# Altium project SnippetsInterfaces.PrjPCB
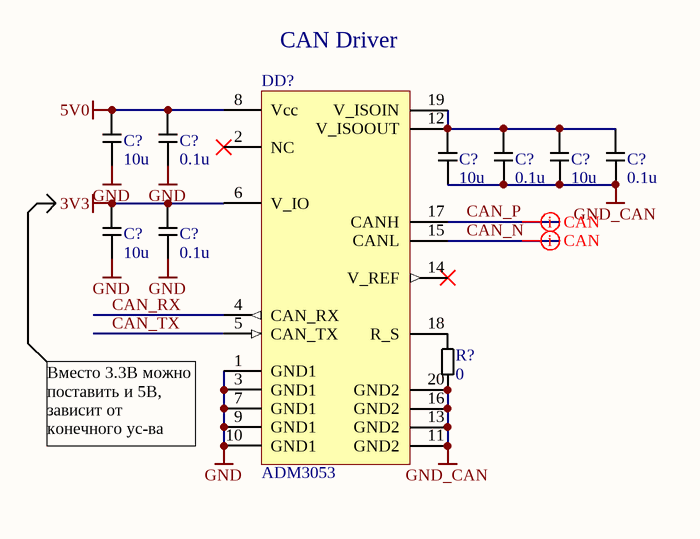
[diagram p0: CAN_ADM3053_Isolated_internal_DCDC.SchDoc]
5 sheets, 70 parts. Net scope: global (net labels, ports and power ports of the same name join across sheets).
Sheets:
  CAN_ADM3053_Isolated_internal_DCDC.SchDoc
  Ethernet_LAN8720_simple.SchDoc
  Ethernet_LAN8742A_simple.SchDoc
  RS232_MAX3232_simple.SchDoc
  RS232_MAX3232_with_rts_cts.SchDoc

## Sheet CAN_ADM3053_Isolated_internal_DCDC.SchDoc
size 420 x 297 mm

### Parts
(Parts that share a designator on the sheet are numbered #1, #2 ... from top to bottom, then left to right.)
C?#1  10u  [C0603]
C?#2  0.1u  [C0603]
C?#3  10u  [C0603]
C?#4  0.1u  [C0603]
C?#5  10u  [C0603]
C?#6  0.1u  [C0603]
C?#7  10u  [C0603]
C?#8  0.1u  [C0603]
DD?#1  ADM3053  [SO-20W]
R?#1  0  [R0603]

### Nets
3V3: C?#7.1 C?#8.1 DD?#1.6(V_IO)
5V0: C?#1.1 C?#2.1 DD?#1.8(Vcc)
GND: C?#1.2 C?#2.2 C?#7.2 C?#8.2 DD?#1.1(GND1) DD?#1.3(GND1) DD?#1.7(GND1) DD?#1.9(GND1) DD?#1.10(GND1)
GND_CAN: C?#3.2 C?#4.2 C?#5.2 C?#6.2 DD?#1.11(GND2) DD?#1.13(GND2) DD?#1.16(GND2) DD?#1.20(GND2) R?#1.2
CAN_N: DD?#1.15(CANL)
CAN_P: DD?#1.17(CANH)
CAN_RX: DD?#1.4(CAN_RX)
CAN_TX: DD?#1.5(CAN_TX)
NetC?#3_1: C?#3.1 C?#4.1 C?#5.1 C?#6.1 DD?#1.12(V_ISOOUT) DD?#1.19(V_ISOIN)
NetDD?#1_18: DD?#1.18(R_S) R?#1.1

Not connected (* = marked no-connect by the designer): DD?#1 2(NC)* 14(V_REF)*

### Layout directives
differential pair: CAN_N, CAN_P

### Notes on the sheet
- (near DD?#1) CAN Driver
- (near DD?#1) Вместо 3.3В можно поставить и 5В, зависит от конечного ус-ва

### Library data of the parts
C?#1-C?#8 = C: Capacitor
DD?#1 = ADM3053: Isolated CAN transceiver with isolated DC-DC
R?#1 = R: Resistor

## Sheet Ethernet_LAN8720_simple.SchDoc
size A4
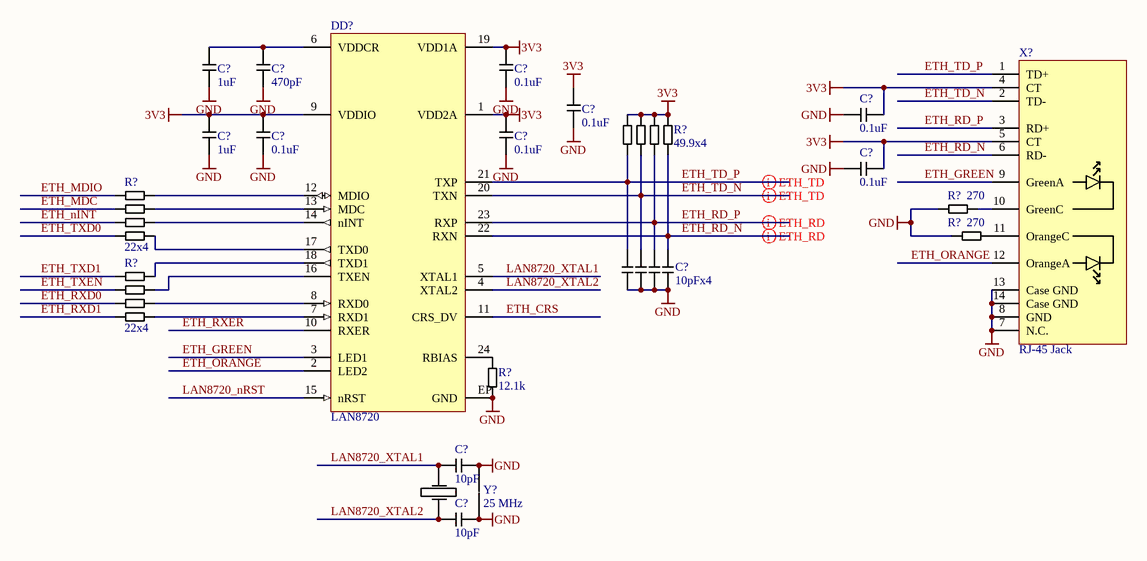
[diagram p1: Ethernet_LAN8720_simple.SchDoc]

### Parts
(Parts that share a designator on the sheet are numbered #1, #2 ... from top to bottom, then left to right.)
C?#9  1uF  [C0603]
C?#10  470pF  [C0603]
C?#11  0.1uF  [C0603]
C?#12  0.1uF  [C0603]
C?#13  0.1uF  [C0603]
C?#14  1uF  [C0603]
C?#15  0.1uF  [C0603]
C?#16  0.1uF  [C0603]
C?#17  0.1uF  [C0603]
C?#18  10pFx4  [C0612-4]
C?#19  10pF  [C0603]
C?#20  10pF  [C0603]
DD?#2  LAN8720  [QFN-24]
R?#2  49.9x4  [R0612-4]
R?#3  22x4  [R0612-4]
R?#4  270  [R0603]
R?#5  270  [R0603]
R?#6  22x4  [R0612-4]
R?#7  12.1k  [R0603]
X?#1  RJ-45 Jack  [J011D21BNL]
Y?#1  25 MHz  [Xtal 0532]

### Nets
3V3: C?#11.1 C?#12.2 C?#13.2 C?#14.1 C?#15.1 C?#16.1 C?#17.2 DD?#2.1(VDD2A) DD?#2.9(VDDIO) DD?#2.19(VDD1A) R?#2.1 R?#2.2 R?#2.3 R?#2.4 X?#1.4(CT) X?#1.5(CT)
GND: C?#9.2 C?#10.2 C?#11.2 C?#12.1 C?#13.1 C?#14.2 C?#15.2 C?#16.2 C?#17.1 C?#18.5 C?#18.6 C?#18.7 C?#18.8 C?#19.2 C?#20.2 DD?#2.EP(GND) R?#4.1 R?#5.1 R?#7.1 X?#1.7(N.C.) X?#1.8(GND) X?#1.13(Case_GND) X?#1.14(Case_GND) Y?#1.1(X1) Y?#1.3(X2)
ETH_CRS: DD?#2.11(CRS_DV)
ETH_GREEN: DD?#2.3(LED1) X?#1.9(GreenA)
ETH_MDC: R?#3.3
ETH_MDIO: R?#3.4
ETH_nINT: R?#3.2
ETH_ORANGE: DD?#2.2(LED2) X?#1.12(OrangeA)
ETH_RD_N: C?#18.4 DD?#2.22(RXN) R?#2.5 X?#1.6(RD-)
ETH_RD_P: C?#18.3 DD?#2.23(RXP) R?#2.6 X?#1.3(RD+)
ETH_RXD0: R?#6.2
ETH_RXD1: R?#6.1
ETH_RXER: DD?#2.10(RXER)
ETH_TD_N: C?#18.2 DD?#2.20(TXN) R?#2.7 X?#1.2(TD-)
ETH_TD_P: C?#18.1 DD?#2.21(TXP) R?#2.8 X?#1.1(TD+)
ETH_TXD0: R?#3.1
ETH_TXD1: R?#6.4
ETH_TXEN: R?#6.3
LAN8720_nRST: DD?#2.15(nRST)
LAN8720_XTAL1: C?#19.1 DD?#2.5(XTAL1) Y?#1.4(GND)
LAN8720_XTAL2: C?#20.1 DD?#2.4(XTAL2) Y?#1.2(GND)
NetC?#9_1: C?#9.1 C?#10.1 DD?#2.6(VDDCR)
NetDD?#2_7: DD?#2.7(RXD1) R?#6.8
NetDD?#2_8: DD?#2.8(RXD0) R?#6.7
NetDD?#2_12: DD?#2.12(MDIO) R?#3.5
NetDD?#2_13: DD?#2.13(MDC) R?#3.6
NetDD?#2_14: DD?#2.14(nINT) R?#3.7
NetDD?#2_16: DD?#2.16(TXEN) R?#6.6
NetDD?#2_17: DD?#2.17(TXD0) R?#3.8
NetDD?#2_18: DD?#2.18(TXD1) R?#6.5
NetDD?#2_24: DD?#2.24(RBIAS) R?#7.2
NetR?#4_2: R?#4.2 X?#1.10(GreenC)
NetR?#5_2: R?#5.2 X?#1.11(OrangeC)

### Layout directives
differential pair: ETH_RD_N, ETH_RD_P, ETH_TD_N, ETH_TD_P

### Library data of the parts
C?#9-C?#17 C?#19 C?#20 = C: Capacitor
C?#18 = Cx4: Capacitors array
DD?#2 = LAN8720: Ethernet PHY
R?#2 R?#3 R?#6 = Rx4: Resistors array
R?#4 R?#5 R?#7 = R: Resistor
X?#1 = RJ-45 Jack: Ethernet jack
Y?#1 = Xtal: Quartz crystal

## Sheet Ethernet_LAN8742A_simple.SchDoc
size A4
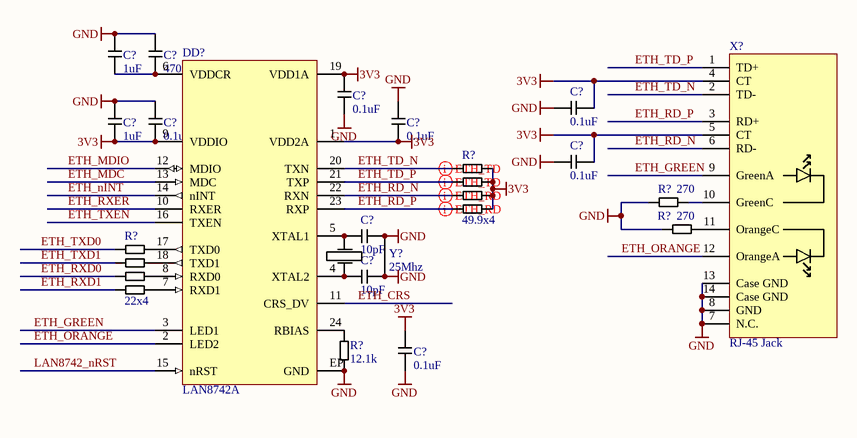
[diagram p2: Ethernet_LAN8742A_simple.SchDoc]

### Parts
(Parts that share a designator on the sheet are numbered #1, #2 ... from top to bottom, then left to right.)
C?#21  1uF  [C0603]
C?#22  470pF  [C0603]
C?#23  0.1uF  [C0603]
C?#24  0.1uF  [C0603]
C?#25  1uF  [C0603]
C?#26  0.1uF  [C0603]
C?#27  0.1uF  [C0603]
C?#28  0.1uF  [C0603]
C?#29  10pF  [C0603]
C?#30  10pF  [C0603]
C?#31  0.1uF  [C0603]
DD?#3  LAN8742A  [QFN-24]
R?#8  49.9x4  [R0508-4]
R?#9  270  [R0603]
R?#10  270  [R0603]
R?#11  22x4  [R0508-4]
R?#12  12.1k  [R0603]
X?#2  RJ-45 Jack  [J011D21BNL]
Y?#2  25Mhz  [XTAL 2532]

### Nets
3V3: C?#23.1 C?#24.2 C?#25.2 C?#26.2 C?#27.2 C?#28.2 C?#31.2 DD?#3.1(VDD2A) DD?#3.9(VDDIO) DD?#3.19(VDD1A) R?#8.5 R?#8.6 R?#8.7 R?#8.8 X?#2.4(CT) X?#2.5(CT)
GND: C?#21.1 C?#22.1 C?#23.2 C?#24.1 C?#25.1 C?#26.1 C?#27.1 C?#28.1 C?#29.2 C?#30.2 C?#31.1 DD?#3.EP(GND) R?#9.1 R?#10.1 R?#12.1 X?#2.7(N.C.) X?#2.8(GND) X?#2.13(Case_GND) X?#2.14(Case_GND) Y?#2.1(GND) Y?#2.3(GND)
ETH_CRS: DD?#3.11(CRS_DV)
ETH_GREEN: DD?#3.3(LED1) X?#2.9(GreenA)
ETH_MDC: DD?#3.13(MDC)
ETH_MDIO: DD?#3.12(MDIO)
ETH_nINT: DD?#3.14(nINT)
ETH_ORANGE: DD?#3.2(LED2) X?#2.12(OrangeA)
ETH_RD_N: DD?#3.22(RXN) R?#8.2 X?#2.6(RD-)
ETH_RD_P: DD?#3.23(RXP) R?#8.1 X?#2.3(RD+)
ETH_RXD0: R?#11.2
ETH_RXD1: R?#11.1
ETH_RXER: DD?#3.10(RXER)
ETH_TD_N: DD?#3.20(TXN) R?#8.4 X?#2.2(TD-)
ETH_TD_P: DD?#3.21(TXP) R?#8.3 X?#2.1(TD+)
ETH_TXD0: R?#11.4
ETH_TXD1: R?#11.3
ETH_TXEN: DD?#3.16(TXEN)
LAN8742_nRST: DD?#3.15(nRST)
NetC?#21_2: C?#21.2 C?#22.2 DD?#3.6(VDDCR)
NetC?#29_1: C?#29.1 DD?#3.5(XTAL1) Y?#2.4(X2)
NetC?#30_1: C?#30.1 DD?#3.4(XTAL2) Y?#2.2(X1)
NetDD?#3_7: DD?#3.7(RXD1) R?#11.8
NetDD?#3_8: DD?#3.8(RXD0) R?#11.7
NetDD?#3_17: DD?#3.17(TXD0) R?#11.5
NetDD?#3_18: DD?#3.18(TXD1) R?#11.6
NetDD?#3_24: DD?#3.24(RBIAS) R?#12.2
NetR?#9_2: R?#9.2 X?#2.10(GreenC)
NetR?#10_2: R?#10.2 X?#2.11(OrangeC)

### Layout directives
differential pair: ETH_RD_N, ETH_RD_P, ETH_TD_N, ETH_TD_P

### Library data of the parts
C?#21-C?#31 = C: Capacitor
DD?#3 = LAN8742A: Ethernet PHY
R?#8 R?#11 = Rx4: Resistors array
R?#9 R?#10 R?#12 = R: Resistor
X?#2 = RJ-45 Jack: Ethernet jack
Y?#2 = Xtal: Quartz crystal

## Sheet RS232_MAX3232_simple.SchDoc
size A4
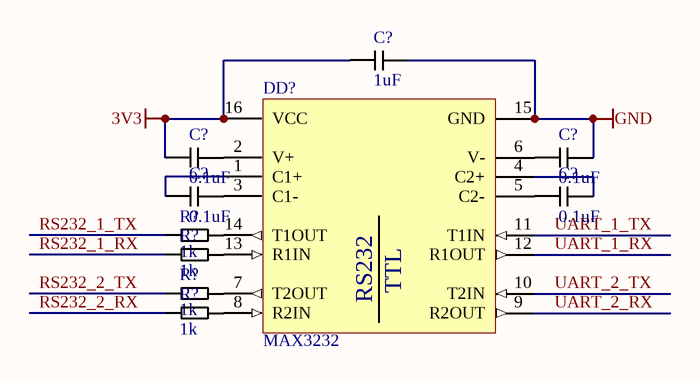
[diagram p3: RS232_MAX3232_simple.SchDoc]

### Parts
(Parts that share a designator on the sheet are numbered #1, #2 ... from top to bottom, then left to right.)
C?#32  1uF  [C0603]
C?#33  0.1uF  [C0603]
C?#34  0.1uF  [C0603]
C?#35  0.1uF  [C0603]
C?#36  0.1uF  [C0603]
DD?#4  MAX3232  [TSSOP-16]
R?#13  1k  [R0603]
R?#14  1k  [R0603]
R?#15  1k  [R0603]
R?#16  1k  [R0603]

### Nets
3V3: C?#32.1 C?#33.1 DD?#4.16(VCC)
GND: C?#32.2 C?#34.2 DD?#4.15(GND)
RS232_1_RX: R?#14.1
RS232_1_TX: R?#13.1
RS232_2_RX: R?#16.1
RS232_2_TX: R?#15.1
UART_1_RX: DD?#4.12(R1OUT)
UART_1_TX: DD?#4.11(T1IN)
UART_2_RX: DD?#4.9(R2OUT)
UART_2_TX: DD?#4.10(T2IN)
NetC?#33_2: C?#33.2 DD?#4.2(V+)
NetC?#34_1: C?#34.1 DD?#4.6(V-)
NetC?#35_1: C?#35.1 DD?#4.1(C1+)
NetC?#35_2: C?#35.2 DD?#4.3(C1-)
NetC?#36_1: C?#36.1 DD?#4.5(C2-)
NetC?#36_2: C?#36.2 DD?#4.4(C2+)
NetDD?#4_7: DD?#4.7(T2OUT) R?#15.2
NetDD?#4_8: DD?#4.8(R2IN) R?#16.2
NetDD?#4_13: DD?#4.13(R1IN) R?#14.2
NetDD?#4_14: DD?#4.14(T1OUT) R?#13.2

### Notes on the sheet
- (in symbol MAX3232) TTL; RS232

### Library data of the parts
C?#32-C?#36 = C: Capacitor
DD?#4 = MAX3232: MAX3232 TTL/CMOS<-->RS-232
R?#13-R?#16 = R: Resistor

## Sheet RS232_MAX3232_with_rts_cts.SchDoc
size A4
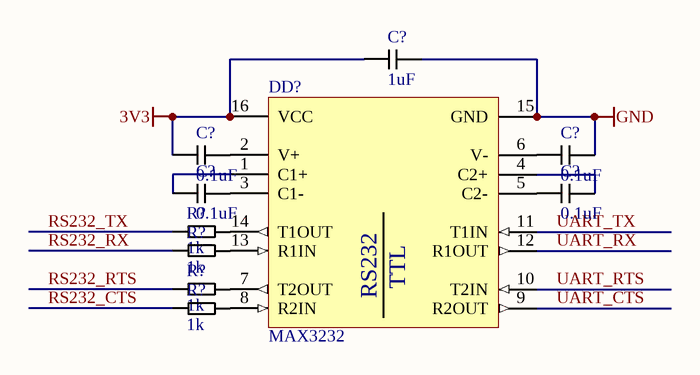
[diagram p4: RS232_MAX3232_with_rts_cts.SchDoc]

### Parts
(Parts that share a designator on the sheet are numbered #1, #2 ... from top to bottom, then left to right.)
C?#37  1uF  [C0603]
C?#38  0.1uF  [C0603]
C?#39  0.1uF  [C0603]
C?#40  0.1uF  [C0603]
C?#41  0.1uF  [C0603]
DD?#5  MAX3232  [TSSOP-16]
R?#17  1k  [R0603]
R?#18  1k  [R0603]
R?#19  1k  [R0603]
R?#20  1k  [R0603]

### Nets
3V3: C?#37.1 C?#38.1 DD?#5.16(VCC)
GND: C?#37.2 C?#39.2 DD?#5.15(GND)
RS232_CTS: R?#20.1
RS232_RTS: R?#19.1
RS232_RX: R?#18.1
RS232_TX: R?#17.1
UART_CTS: DD?#5.9(R2OUT)
UART_RTS: DD?#5.10(T2IN)
UART_RX: DD?#5.12(R1OUT)
UART_TX: DD?#5.11(T1IN)
NetC?#38_2: C?#38.2 DD?#5.2(V+)
NetC?#39_1: C?#39.1 DD?#5.6(V-)
NetC?#40_1: C?#40.1 DD?#5.1(C1+)
NetC?#40_2: C?#40.2 DD?#5.3(C1-)
NetC?#41_1: C?#41.1 DD?#5.5(C2-)
NetC?#41_2: C?#41.2 DD?#5.4(C2+)
NetDD?#5_7: DD?#5.7(T2OUT) R?#19.2
NetDD?#5_8: DD?#5.8(R2IN) R?#20.2
NetDD?#5_13: DD?#5.13(R1IN) R?#18.2
NetDD?#5_14: DD?#5.14(T1OUT) R?#17.2

### Notes on the sheet
- (in symbol MAX3232) TTL; RS232

### Library data of the parts
C?#37-C?#41 = C: Capacitor
DD?#5 = MAX3232: MAX3232 TTL/CMOS<-->RS-232
R?#17-R?#20 = R: Resistor

## Nets that join several sheets
3V3: CAN_ADM3053_Isolated_internal_DCDC (C?#7.1 C?#8.1 DD?#1.6), Ethernet_LAN8720_simple (16 pins), Ethernet_LAN8742A_simple (16 pins), RS232_MAX3232_simple (C?#32.1 C?#33.1 DD?#4.16), RS232_MAX3232_with_rts_cts (C?#37.1 C?#38.1 DD?#5.16)
GND: CAN_ADM3053_Isolated_internal_DCDC (9 pins), Ethernet_LAN8720_simple (25 pins), Ethernet_LAN8742A_simple (21 pins), RS232_MAX3232_simple (C?#32.2 C?#34.2 DD?#4.15), RS232_MAX3232_with_rts_cts (C?#37.2 C?#39.2 DD?#5.15)
ETH_CRS: Ethernet_LAN8720_simple (DD?#2.11), Ethernet_LAN8742A_simple (DD?#3.11)
ETH_GREEN: Ethernet_LAN8720_simple (DD?#2.3 X?#1.9), Ethernet_LAN8742A_simple (DD?#3.3 X?#2.9)
ETH_MDC: Ethernet_LAN8720_simple (R?#3.3), Ethernet_LAN8742A_simple (DD?#3.13)
ETH_MDIO: Ethernet_LAN8720_simple (R?#3.4), Ethernet_LAN8742A_simple (DD?#3.12)
ETH_nINT: Ethernet_LAN8720_simple (R?#3.2), Ethernet_LAN8742A_simple (DD?#3.14)
ETH_ORANGE: Ethernet_LAN8720_simple (DD?#2.2 X?#1.12), Ethernet_LAN8742A_simple (DD?#3.2 X?#2.12)
ETH_RD_N: Ethernet_LAN8720_simple (C?#18.4 DD?#2.22 R?#2.5 X?#1.6), Ethernet_LAN8742A_simple (DD?#3.22 R?#8.2 X?#2.6)
ETH_RD_P: Ethernet_LAN8720_simple (C?#18.3 DD?#2.23 R?#2.6 X?#1.3), Ethernet_LAN8742A_simple (DD?#3.23 R?#8.1 X?#2.3)
ETH_RXD0: Ethernet_LAN8720_simple (R?#6.2), Ethernet_LAN8742A_simple (R?#11.2)
ETH_RXD1: Ethernet_LAN8720_simple (R?#6.1), Ethernet_LAN8742A_simple (R?#11.1)
ETH_RXER: Ethernet_LAN8720_simple (DD?#2.10), Ethernet_LAN8742A_simple (DD?#3.10)
ETH_TD_N: Ethernet_LAN8720_simple (C?#18.2 DD?#2.20 R?#2.7 X?#1.2), Ethernet_LAN8742A_simple (DD?#3.20 R?#8.4 X?#2.2)
ETH_TD_P: Ethernet_LAN8720_simple (C?#18.1 DD?#2.21 R?#2.8 X?#1.1), Ethernet_LAN8742A_simple (DD?#3.21 R?#8.3 X?#2.1)
ETH_TXD0: Ethernet_LAN8720_simple (R?#3.1), Ethernet_LAN8742A_simple (R?#11.4)
ETH_TXD1: Ethernet_LAN8720_simple (R?#6.4), Ethernet_LAN8742A_simple (R?#11.3)
ETH_TXEN: Ethernet_LAN8720_simple (R?#6.3), Ethernet_LAN8742A_simple (DD?#3.16)